# EasyEDA schematic Dazzler.json

## Sheets
1 Audio
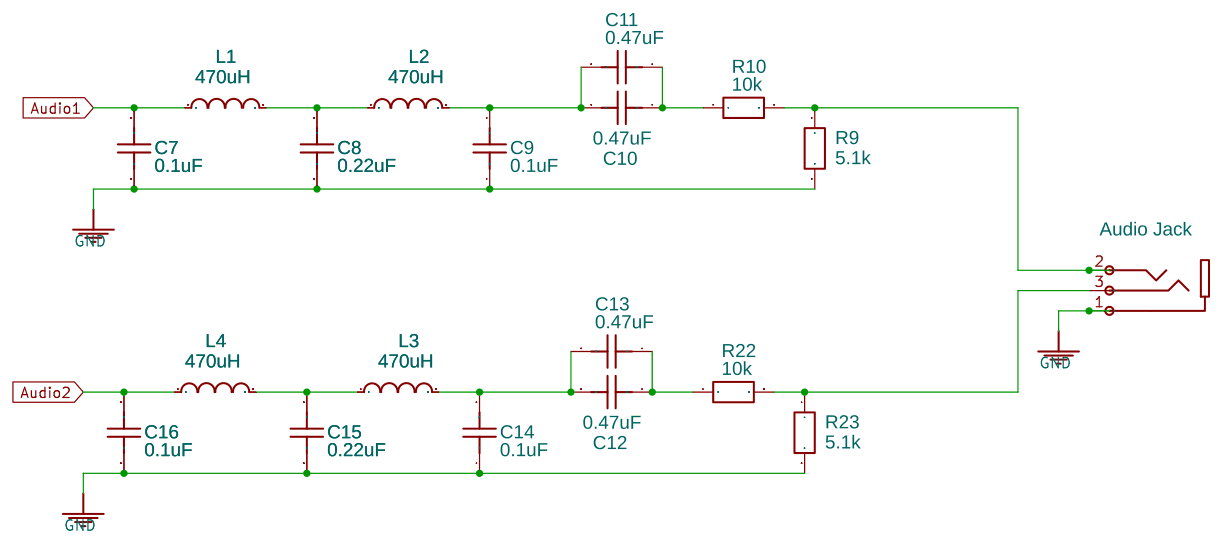
[diagram p0: Audio]
2 MCU
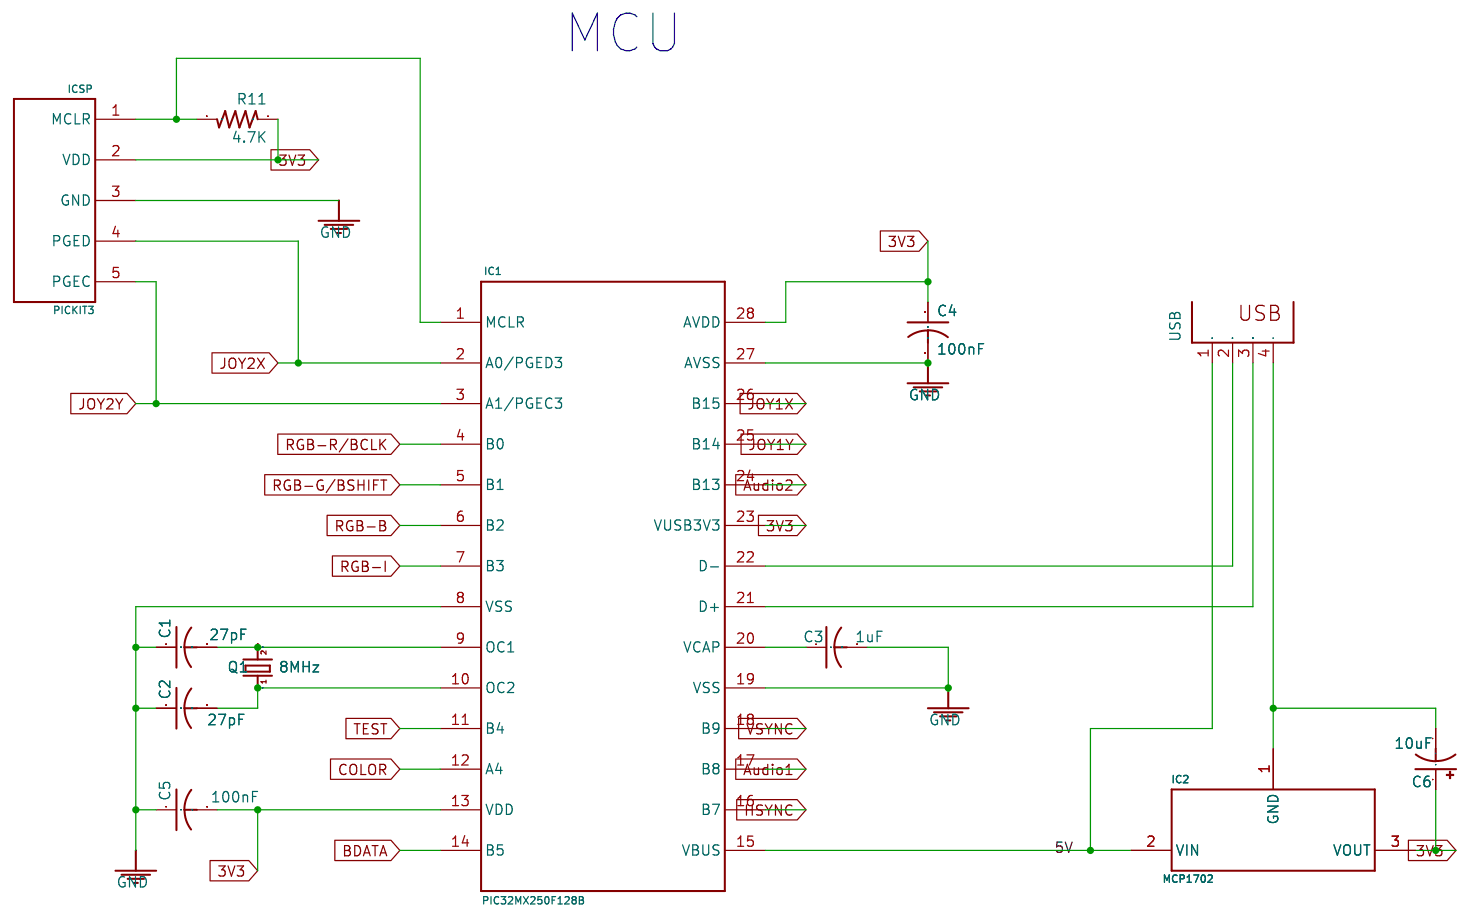
[diagram p1: MCU]
3 Video
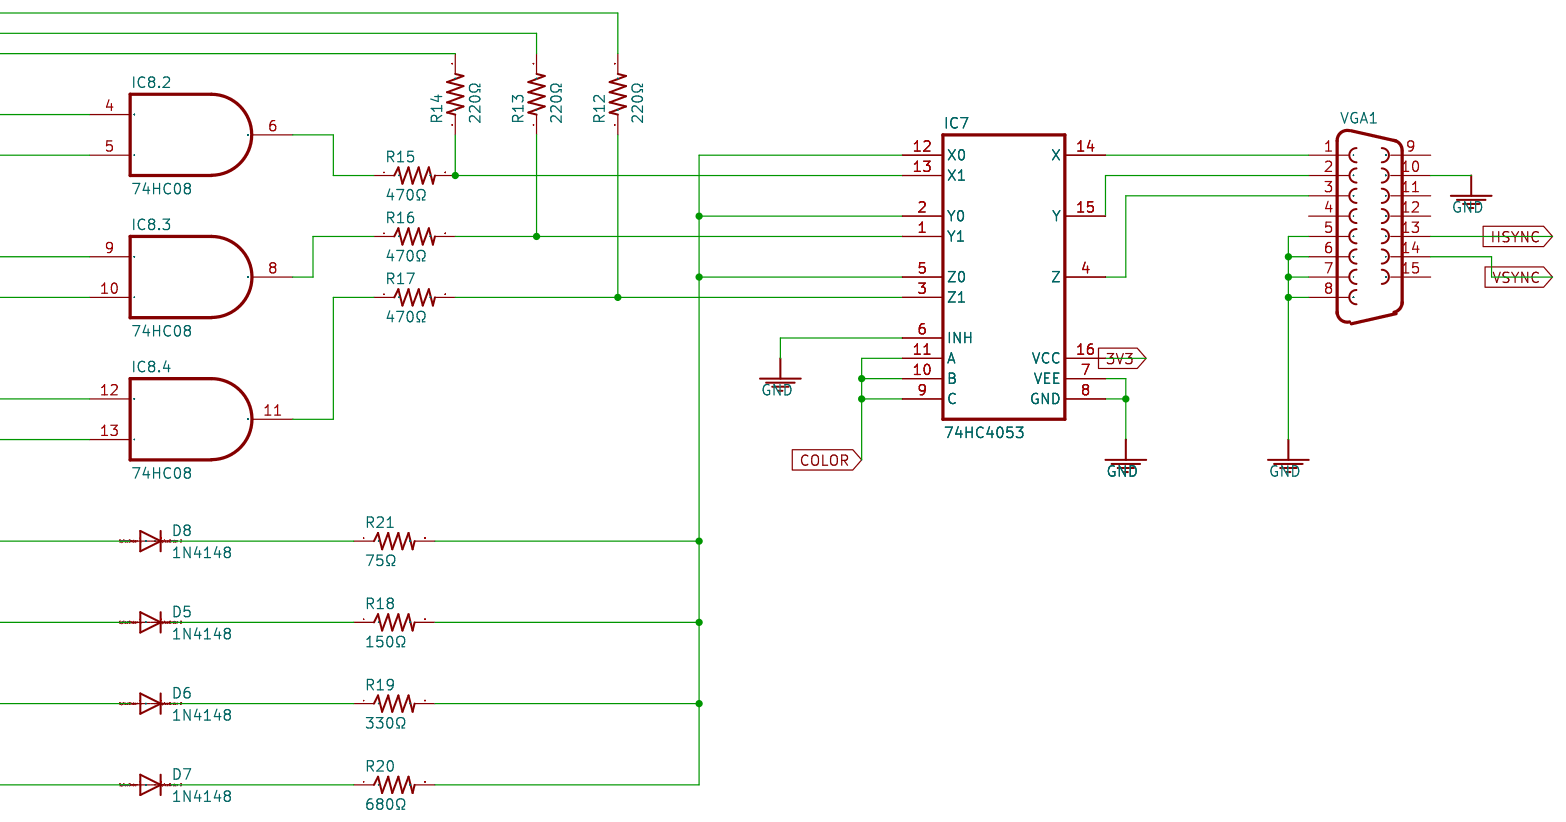
[diagram p2: Video]
4 Joystick
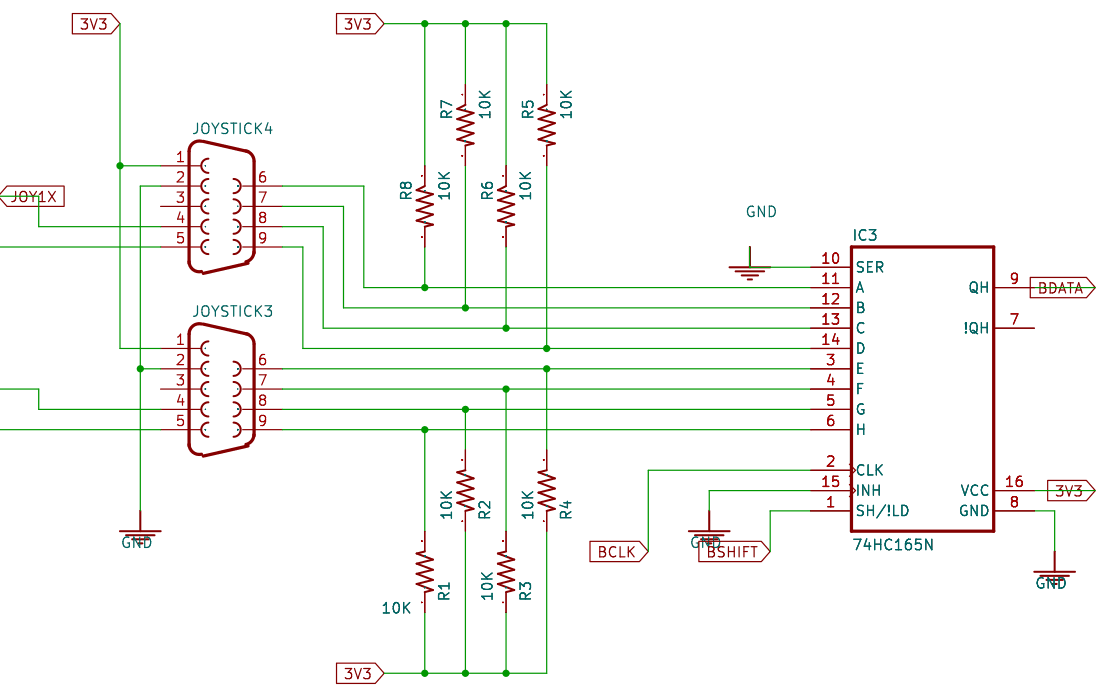
[diagram p3: Joystick]

## Parts
sheet Audio
C7  0.1uF  [RAD-0.1]
C8  0.22uF  [RAD-0.1]
C9  0.1uF  [RAD-0.1]
C10  0.47uF  [RAD-0.1]
C11  0.47uF  [RAD-0.1]
C12  0.47uF  [RAD-0.1]
C13  0.47uF  [RAD-0.1]
C14  0.1uF  [RAD-0.1]
C15  0.22uF  [RAD-0.1]
C16  0.1uF  [RAD-0.1]
J1  Audio Jack  [AUDIO-PJ001]
L1  470uH  [AXIAL-0.4]
L2  470uH  [AXIAL-0.4]
L3  470uH  [AXIAL-0.4]
L4  470uH  [AXIAL-0.4]
R9  5.1k  [AXIAL-0.3]
R10  10k  [AXIAL-0.3]
R22  10k  [AXIAL-0.3]
R23  5.1k  [AXIAL-0.3]
sheet Joystick
IC3  74HC165N  [DIL16]
JOYSTICK3  F09V  [F09V]
JOYSTICK4  F09V  [F09V]
R1  10K  [P0613/15]
R2  10K  [P0613/15]
R3  10K  [P0613/15]
R4  10K  [P0613/15]
R5  10K  [P0613/15]
R6  10K  [P0613/15]
R7  10K  [P0613/15]
R8  10K  [P0613/15]
sheet MCU
C1  27pF  [C025-024X044]
C2  27pF  [C025-024X044]
C3  1uF  [C025-024X044]
C4  100nF  [C025-024X044]
C5  100nF  [C025-024X044]
C6  10uF  [E15-6]
IC1  PIC32MX250F128B  [DIL28-3]
IC2  MCP1702  [TO92]
ICSP  PICKIT3  [1X05]
Q1  8MHz  [HC33U-V]
R11  4.7K  [P0613/15]
USB  PN61729  [PN61729]
sheet Video
D5  1N4148  [DO35-7]
D6  1N4148  [DO35-7]
D7  1N4148  [DO35-7]
D8  1N4148  [DO35-7]
IC7  74HC4053  [DIL16]
IC8  74HC08  [DIL14]  (sections 2,3,4)
R12  220Ω  [P0613/15]
R13  220Ω  [P0613/15]
R14  220Ω  [P0613/15]
R15  470Ω  [P0613/15]
R16  470Ω  [P0613/15]
R17  470Ω  [P0613/15]
R18  150Ω  [P0613/15]
R19  330Ω  [P0613/15]
R20  680Ω  [P0613/15]
R21  75Ω  [P0613/15]
VGA1  F15HDV  [HDF15V]

## Library data of the parts
C7-C16 = Cap_RAD-0.1_US
J1 = -: Supplier Part: C3792; Supplier: LCSC; Manufacturer: ReliaPro; Manufacturer Part: 320B/PJ-001 3.5Jacks; image: http://image.lceda.cn/szlcsc/C3792.jpg
L1-L4 = Inductor_AXIAL-0.4_US
R9 R10 R22 R23 = Res_AXIAL-0.3(1/8W)_EU

## Nets
3V3: C4.1 C5.2 C6.+ IC1.13(VDD) IC1.23(VUSB3V3) IC1.28(AVDD) IC2.3(VOUT) IC3.16(VCC) IC7.16(VCC) ICSP.2(VDD) JOYSTICK3.1 JOYSTICK4.1 R1.1 R2.1 R3.1 R4.1 R5.1 R6.1 R7.1 R8.1 R11.1
5V: IC1.15(VBUS) IC2.2(VIN) USB.1
GND: C1.1 C2.1 C3.2 C4.2 C5.1 C7.1 C8.1 C9.1 C14.1 C15.1 C16.1 IC1.8(VSS) IC1.19(VSS) IC1.27(AVSS) IC3.8(GND) IC3.10(SER) IC3.15(INH) IC7.6(INH) IC7.7(VEE) IC7.8(GND) ICSP.3(GND) J1.1 JOYSTICK3.2 JOYSTICK4.2 R9.2 R23.2 VGA1.5 VGA1.6 VGA1.7 VGA1.8 VGA1.10
Audio1: C7.2 IC1.17(B8) L1.1
Audio2: C16.2 IC1.24(B13) L4.1
BCLK: IC3.2(CLK)
BDATA: IC1.14(B5) IC3.9(QH)
BSHIFT: IC3.1(SH/!LD)
COLOR: IC1.12(A4) IC7.9(C) IC7.10(B) IC7.11(A)
HSYNC: IC1.16(B7) VGA1.13
JOY1X: IC1.26(B15) JOYSTICK4.4
JOY1Y: IC1.25(B14) JOYSTICK4.5
JOY2X: IC1.2(A0/PGED3) ICSP.4(PGED) JOYSTICK3.4
JOY2Y: IC1.3(A1/PGEC3) ICSP.5(PGEC) JOYSTICK3.5
RGB-B: D5.A IC1.6(B2) IC8.12(I0) R12.2
RGB-G/BSHIFT: D6.A IC1.5(B1) IC8.9(I0) R13.2
RGB-I: D8.A IC1.7(B3) IC8.5(I1) IC8.10(I1) IC8.13(I1)
RGB-R/BCLK: D7.A IC1.4(B0) IC8.4(I0) R14.2
TEST: IC1.11(B4)
VSYNC: IC1.18(B9) VGA1.14
Net-(C1-2): C1.2 IC1.9(OC1) Q1.2
Net-(C2-2): C2.2 IC1.10(OC2) Q1.1
Net-(C3-1): C3.1 IC1.20(VCAP)
Net-(C6--): C6.- IC2.1(GND) USB.4
Net-(C8-2): C8.2 L1.2 L2.1
Net-(C9-2): C9.2 C10.2 C11.2 L2.2
Net-(C10-1): C10.1 C11.1 R10.1
Net-(C12-1): C12.1 C13.1 R22.1
Net-(C12-2): C12.2 C13.2 C14.2 L3.2
Net-(C15-2): C15.2 L3.1 L4.2
Net-(D5-C): D5.C R18.1
Net-(D6-C): D6.C R19.1
Net-(D7-C): D7.C R20.1
Net-(D8-C): D8.C R21.1
Net-(IC1-1): IC1.1(MCLR) ICSP.1(MCLR) R11.2
Net-(IC1-21): IC1.21(D+) USB.3
Net-(IC1-22): IC1.22(D-) USB.2
Net-(IC3-3): IC3.3(E) JOYSTICK3.6 R4.2
Net-(IC3-4): IC3.4(F) JOYSTICK3.7 R3.2
Net-(IC3-5): IC3.5(G) JOYSTICK3.8 R2.2
Net-(IC3-6): IC3.6(H) JOYSTICK3.9 R1.2
Net-(IC3-11): IC3.11(A) JOYSTICK4.6 R8.2
Net-(IC3-12): IC3.12(B) JOYSTICK4.7 R7.2
Net-(IC3-13): IC3.13(C) JOYSTICK4.8 R6.2
Net-(IC3-14): IC3.14(D) JOYSTICK4.9 R5.2
Net-(IC7-1): IC7.1(Y1) R13.1 R16.2
Net-(IC7-2): IC7.2(Y0) IC7.5(Z0) IC7.12(X0) R18.2 R19.2 R20.2 R21.2
Net-(IC7-3): IC7.3(Z1) R12.1 R17.2
Net-(IC7-4): IC7.4(Z) VGA1.3
Net-(IC7-13): IC7.13(X1) R14.1 R15.2
Net-(IC7-14): IC7.14(X) VGA1.1
Net-(IC7-15): IC7.15(Y) VGA1.2
Net-(IC8.2-6): IC8.6(O) R15.1
Net-(IC8.3-8): IC8.8(O) R16.1
Net-(IC8.4-11): IC8.11(O) R17.1
Net-(J1-2): J1.2 R9.1 R10.2
Net-(J1-3): J1.3 R22.2 R23.1

Not connected (* = marked no-connect by the designer): IC3 7(!QH); JOYSTICK3 3; JOYSTICK4 3; VGA1 4 9 11 12 15

## Notes on the sheets
sheet 1
- Audio
sheet 2
- MCU
sheet 3
- Video Signal Generator
sheet 4
- Joysticks
